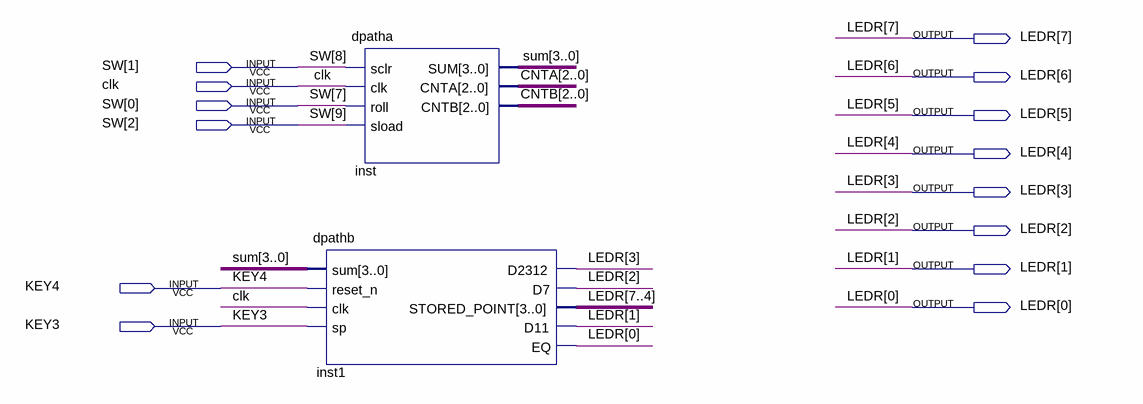
[diagram p0: schematic sheet]
// Quartus schematic Dice_Game.bdf as structural Verilog: 2 symbols, 14 pins
module Dice_Game (
  input  [2:0] SW,
  input  clk,
  input  KEY4,
  input  KEY3,
  output [7:0] LEDR
);

  wire [2:0] CNTA, CNTB;
  wire [3:0] sum;

  dpathb inst1 (
    .sum(sum), .reset_n(KEY4), .clk(clk), .sp(KEY3), .D2312(LEDR[3]), .D7(LEDR[2]), .STORED_POINT(LEDR[7:4]),
    .D11(LEDR[1]), .EQ(LEDR[0]));
  dpatha inst (.sclr(SW[1]), .clk(clk), .roll(SW[0]), .sload(SW[2]), .SUM(sum), .CNTA(CNTA), .CNTB(CNTB));

  // Other names for the same wires on the sheet: SW[9:7] = SW
endmodule
